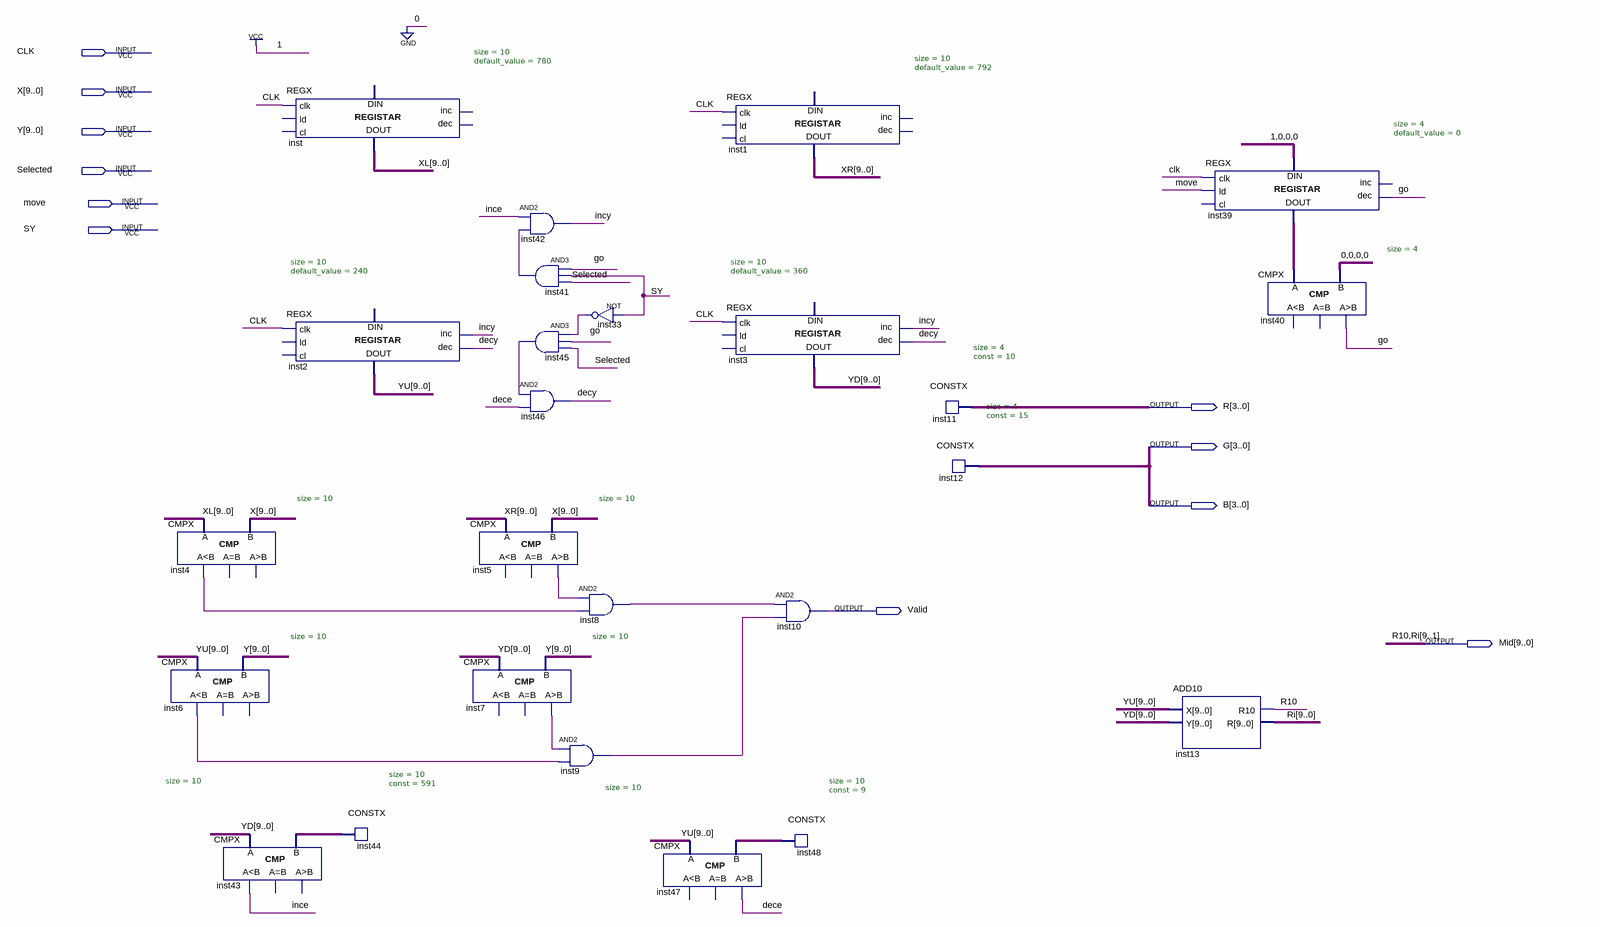
[diagram p0: schematic sheet]
// Quartus schematic Layer2.bdf as structural Verilog: 25 symbols, 11 pins
module Layer2 (
  input  CLK,
  input  [9:0] X,
  input  [9:0] Y,
  input  Selected,
  input  move,
  input  SY,
  output [3:0] R,
  output [3:0] G,
  output [3:0] B,
  output Valid,
  output [9:0] Mid
);

  wire dece, decy, go, ince, incy, inst4_ls, inst5_gr, inst6_ls, inst7_gr, inst8_out, inst9_out, inst33_out,
       inst41_out, inst45_out;
  wire [0:0] Ri;
  wire [3:0] inst39_data_out;
  wire [9:0] inst44_data, inst48_data, XL, XR, YD, YU;

  CMPX #(.size(10)) inst4 (.A(XL), .B(X), .ls(inst4_ls));  // open: eq, gr
  CMPX #(.size(10)) inst6 (.A(YU), .B(Y), .ls(inst6_ls));  // open: eq, gr
  CMPX #(.size(10)) inst43 (.A(YD), .B(inst44_data), .ls(ince));  // open: eq, gr
  REGX #(.size(10), .default_value(780)) inst (.clk(CLK), .data_out(XL));  // open: ld, cl, inc, dec, data_in
  REGX #(.size(10), .default_value(240)) inst2 (
    .clk(CLK), .inc(incy), .dec(decy), .data_out(YU));  // open: ld, cl, data_in
  CONSTX #(.size(10), .\const (591)) inst44 (.data(inst44_data));
  CMPX #(.size(10)) inst5 (.A(XR), .B(X), .gr(inst5_gr));  // open: ls, eq
  CMPX #(.size(10)) inst7 (.A(YD), .B(Y), .gr(inst7_gr));  // open: ls, eq
  and inst42 (incy, ince, inst41_out);
  and inst41 (inst41_out, go, SY, Selected);
  and inst45 (inst45_out, inst33_out, go, Selected);
  and inst46 (decy, inst45_out, dece);
  not inst33 (inst33_out, SY);
  and inst8 (inst8_out, inst5_gr, inst4_ls);
  and inst9 (inst9_out, inst7_gr, inst6_ls);
  CMPX #(.size(10)) inst47 (.A(YU), .B(inst48_data), .gr(dece));  // open: ls, eq
  REGX #(.size(10), .default_value(792)) inst1 (.clk(CLK), .data_out(XR));  // open: ld, cl, inc, dec, data_in
  REGX #(.size(10), .default_value(360)) inst3 (
    .clk(CLK), .inc(incy), .dec(decy), .data_out(YD));  // open: ld, cl, data_in
  and inst10 (Valid, inst8_out, inst9_out);
  CONSTX #(.size(10), .\const (9)) inst48 (.data(inst48_data));
  CONSTX #(.size(4), .\const (10)) inst11 (.data(R));
  CONSTX #(.size(4), .\const (15)) inst12 (.data(B));
  ADD10 inst13 (.X(YU), .Y(YD), .R10(Mid[9]), .R({Mid[8:0], Ri[0]}));
  REGX #(.size(4), .default_value(0)) inst39 (
    .clk(CLK), .ld(move), .dec(go), .data_in(4'b1000), .data_out(inst39_data_out));  // open: cl, inc
  CMPX #(.size(4)) inst40 (.A(inst39_data_out), .B(4'b0000), .gr(go));  // open: ls, eq

  assign G = B;

  // Other names for the same wires on the sheet: R10 = Mid[9]; Ri[9:1] = Mid[8:0]
endmodule
